# EAGLE design PQS42019.1 v5 (EAGLE 9.3.2)
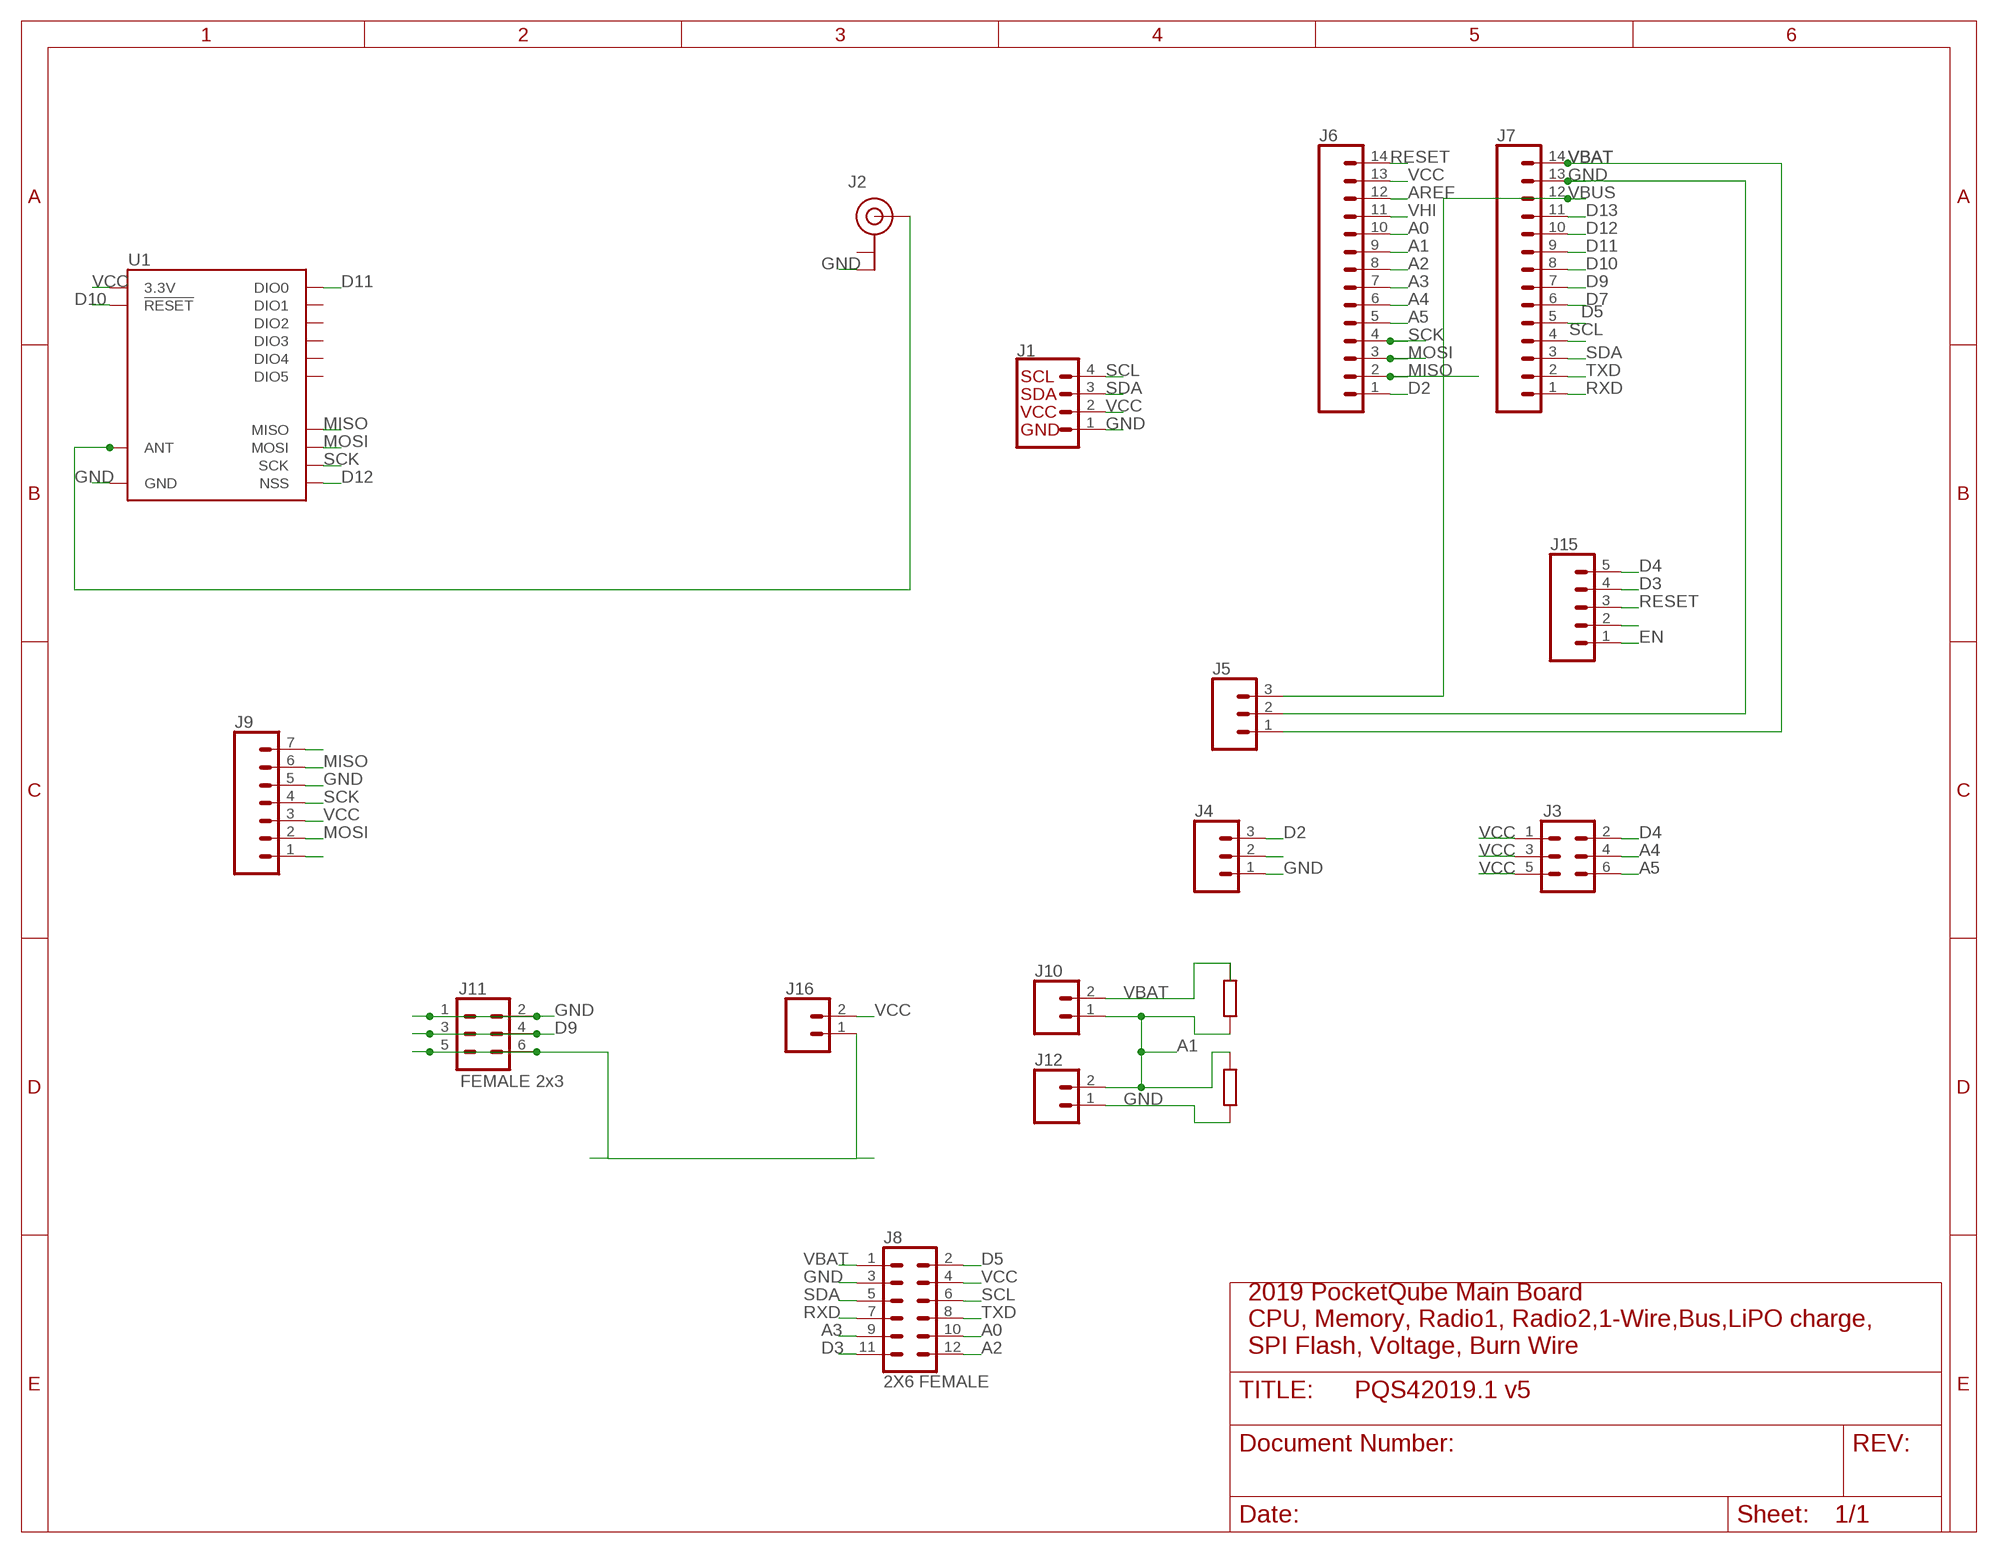
[diagram p0: schematic, sheet 1]

## Parts
J1  QWIIC_CONNECTORJS-1MM  [1X04_1MM_RA]
J2  U.FL  [U.FL]
J3  CONN_03X2NO_SILK  [2X3-NS]
J4  CONN_03  [1X03]
J5  CONN_03  [1X03]
J6  CONN_14  [1X14]
J7  CONN_14  [1X14]
J8  2X6 FEMALE  CONN_06X2PTH_FEMALE  [2X6]
J9  CONN_07  [1X07]
J10  CONN_02  [1X02]
J11  FEMALE 2x3  CONN_03X2FEMALE  [2X3]
J12  CONN_02  [1X02]
J15  CONN_05  [1X05]
J16  CONN_02  [1X02]
U1  RFM95W  [RFM95/96/97/98W]

## Nets
A0: J6.10 J8.10
A1: J6.9 J10.1 J12.2
A2: J6.8 J8.12
A3: J6.7 J8.9
A4: J3.4 J6.6
A5: J3.6 J6.5
AREF: J6.12
D2: J4.3 J6.1
D3: J8.11 J15.4
D4: J3.2 J15.5
D5: J7.5 J8.2
D7: J7.6 J9.1
D9: J7.7 J11.3 J11.4
D10: J7.8 U1.!RESET
D11: J7.9 U1.DIO0
D12: J7.10 U1.NSS
D13: J7.11
EN: J15.1
GND [power]: J1.1(GND) J2.2(GND) J4.1 J5.2 J7.13 J8.3 J9.5 J11.1 J11.2 J12.1 U1.GND@1(GND) U1.GND@2(GND) U1.GND@3(GND)
MISO: J6.2 J9.6 U1.MISO
MOSI: J6.3 J9.2 U1.MOSI
N$1: J9.7
N$2: J4.2
N$8: J15.2
N$10: J11.5 J11.6 J16.1
N$13: J2.FEED(SIGNAL) U1.ANT
RESET: J6.14 J15.3
RXD: J7.1 J8.7
SCK: J6.4 J9.4 U1.SCK
SCL: J1.4(SCL) J7.4 J8.6
SDA: J1.3(SDA) J7.3 J8.5
TXD: J7.2 J8.8
VBAT [power]: J5.1 J7.14 J8.1 J10.2
VBUS [power]: J5.3 J7.12
VCC: J1.2(VCC) J3.1 J3.3 J3.5 J6.13 J8.4 J9.3 J16.2 U1.3.3V
VHI: J6.11
Unconnected: J2.1(GND) U1.DIO1 U1.DIO2 U1.DIO3 U1.DIO4 U1.DIO5

## Notes on the sheet
- 2019 PocketQube Main Board
  CPU, Memory, Radio1, Radio2,1-Wire,Bus,LiPO charge, 
  SPI Flash, Voltage, Burn Wire

## Library data of the parts
J1 = SparkFun-Connectors:QWIIC_CONNECTOR: SparkFun I2C Standard Qwiic Connector An SMD 1mm pitch JST connector makes it easy and quick (get it? Qwiic?) to connect I2C devices to each other. The Qwiic system <http://www.sparkfun.com/qwiic> enables fast and solderless connection between popular platforms and various sensors and actuators. We carry 200mm <https://www.sparkfun.com/products/14204>, 100mm <https://www.sparkfun.com/products/14205>, 50mm <https://www.sparkfun.com/products/14206>, and breadboard friendly <https://www.sparkfun.com/products/14207> Qwiic cables. We also offer 10 pcs strips <https://www.sparkfun.com/products/14323> the SMD connectors.
J2 = SparkFun-Connectors:U.FL: SMD Antenna Connector - U.FL 2mm height, 3.0mm x 3.0mm receptacle size. SparkFun Products: SparkFun WiFi Shield - ESP8266 <https://www.sparkfun.com/products/13287> SparkFun ESP8266 Thing <https://www.sparkfun.com/products/13231> SparkFun MiniGen - Pro Mini Signal Generator Shield <https://www.sparkfun.com/products/11420>; PROD_ID: CONN-09193; SF_ID: WRL-09144
J3 = SparkFun-Connectors:CONN_03X2: Multi connection point. Often used as Generic Header-pin footprint for 0.1 inch spaced/style header connections You can populate with any combo of single row headers, but if you'd like an exact match, check these: Header - 2x3 (Male, 0.1") <https://www.sparkfun.com/products/12807> (PRT-12807) Header - 2x3 (Female, 0.1") <https://www.sparkfun.com/products/13010> (PRT-13010) 2x3 Pin Shrouded Header <https://www.sparkfun.com/products/10877> (PRT-10877) On any of the 0.1 inch spaced packages, you can populate with these: Break Away Headers - Straight <https://www.sparkfun.com/products/116> (PRT-00116) Break Away Male Headers - Right Angle <https://www.sparkfun.com/products/553> (PRT-00553) Female Headers <https://www.sparkfun.com/products/115> (PRT-00115) Break Away Headers - Machine Pin <https://www.sparkfun.com/products/117> (PRT-00117) Break Away Female Headers - Swiss Machine Pin <https://www.sparkfun.com/products/743> (PRT-00743) Special note: the shrouded connector mates well with our 3x2 ribbon cables: Ribbon Crimp Connector - 6-pin (2x3, Female) <https://www.sparkfun.com/products/10651> (PRT-10651) Ribbon Cable - 6 wire (15ft) <https://www.sparkfun.com/products/10646> (PRT-10646)
J4 J5 = SparkFun-Connectors:CONN_03: Multi connection point. Often used as Generic Header-pin footprint for 0.1 inch spaced/style header connections On any of the 0.1 inch spaced packages, you can populate with these: Break Away Headers - Straight <https://www.sparkfun.com/products/116> (PRT-00116) Break Away Male Headers - Right Angle <https://www.sparkfun.com/products/553> (PRT-00553) Female Headers <https://www.sparkfun.com/products/115> (PRT-00115) Break Away Headers - Machine Pin <https://www.sparkfun.com/products/117> (PRT-00117) Break Away Female Headers - Swiss Machine Pin <https://www.sparkfun.com/products/743> (PRT-00743) Stackable Header - 3 Pin (Female, 0.1") <https://www.sparkfun.com/products/13875> (PRT-13875) For SCREWTERMINALS and SPRING TERMINALS visit here: Screw Terimnals on SparkFun.com <https://www.sparkfun.com/search/results?term=Screw+Terminals> (5mm/3.5mm/2.54mm spacing) This device is also useful as a general connection point to wire up your design to another part of your project. Our various solder wires solder well into these plated through hole pads. Hook-Up Wire - Assortment (Stranded, 22 AWG) <https://www.sparkfun.com/products/11375> (PRT-11375) Hook-Up Wire - Assortment (Solid Core, 22 AWG) <https://www.sparkfun.com/products/11367> (PRT-11367) View the entire wire category on our website here <https://www.sparkfun.com/categories/141> Special notes: Molex polarized connector foot print use with SKU : PRT-08232 with associated crimp pins and housings.
J6 J7 = SparkFun-Connectors:CONN_14: Multi connection point. Often used as Generic Header-pin footprint for 0.1 inch spaced/style header connections On any of the 0.1 inch spaced packages, you can populate with these: Break Away Headers - Straight <https://www.sparkfun.com/products/116> (PRT-00116) Break Away Male Headers - Right Angle <https://www.sparkfun.com/products/553> (PRT-00553) Female Headers <https://www.sparkfun.com/products/115> (PRT-00115) Break Away Headers - Machine Pin <https://www.sparkfun.com/products/117> (PRT-00117) Break Away Female Headers - Swiss Machine Pin <https://www.sparkfun.com/products/743> (PRT-00743) For SCREWTERMINALS and SPRING TERMINALS visit here: Screw Terimnals on SparkFun.com <https://www.sparkfun.com/search/results?term=Screw+Terminals> (5mm/3.5mm/2.54mm spacing) This device is also useful as a general connection point to wire up your design to another part of your project. Our various solder wires solder well into these plated through hole pads. Hook-Up Wire - Assortment (Stranded, 22 AWG) <https://www.sparkfun.com/products/11375> (PRT-11375) Hook-Up Wire - Assortment (Solid Core, 22 AWG) <https://www.sparkfun.com/products/11367> (PRT-11367) View the entire wire category on our website here <https://www.sparkfun.com/categories/141> Special notes: Molex polarized connector foot print use with SKU : PRT-08231 with associated crimp pins and housings. 1MM SMD Version SKU: PRT-10208 NOTES ON THE VARIANTS LOCK and LOCK_LONGPADS... This footprint was designed to help hold the alignment of a through-hole component (i.e. 6-pin header) while soldering it into place. You may notice that each hole has been shifted either up or down by 0.005 of an inch from it's more standard position (which is a perfectly straight line). This slight alteration caused the pins (the squares in the middle) to touch the edges of the holes. Because they are alternating, it causes a "brace" to hold the component in place. 0.005 has proven to be the perfect amount of "off-center" position when using our standard breakaway headers. Although looks a little odd when you look at the bare footprint, once you have a header in there, the alteration is very hard to notice. Also,if you push a header all the way into place, it is covered up entirely on the bottom side.
J8 = SparkFun-Connectors:CONN_06X2: Multi connection point. Often used as Generic Header-pin footprint for 0.1 inch spaced/style header connections On any of the 0.1 inch spaced packages, you can populate with these: Break Away Headers - Straight <https://www.sparkfun.com/products/116> (PRT-00116) Break Away Male Headers - Right Angle <https://www.sparkfun.com/products/553> (PRT-00553) Female Headers <https://www.sparkfun.com/products/115> (PRT-00115) Break Away Headers - Machine Pin <https://www.sparkfun.com/products/117> (PRT-00117) Break Away Female Headers - Swiss Machine Pin <https://www.sparkfun.com/products/743> (PRT-00743); PROD_ID: CONN-12423
J9 = SparkFun-Connectors:CONN_07: Multi connection point. Often used as Generic Header-pin footprint for 0.1 inch spaced/style header connections On any of the 0.1 inch spaced packages, you can populate with these: Break Away Headers - Straight <https://www.sparkfun.com/products/116> (PRT-00116) Break Away Male Headers - Right Angle <https://www.sparkfun.com/products/553> (PRT-00553) Female Headers <https://www.sparkfun.com/products/115> (PRT-00115) Break Away Headers - Machine Pin <https://www.sparkfun.com/products/117> (PRT-00117) Break Away Female Headers - Swiss Machine Pin <https://www.sparkfun.com/products/743> (PRT-00743) For SCREWTERMINALS and SPRING TERMINALS visit here: Screw Terimnals on SparkFun.com <https://www.sparkfun.com/search/results?term=Screw+Terminals> (5mm/3.5mm/2.54mm spacing) This device is also useful as a general connection point to wire up your design to another part of your project. Our various solder wires solder well into these plated through hole pads. Hook-Up Wire - Assortment (Stranded, 22 AWG) <https://www.sparkfun.com/products/11375> (PRT-11375) Hook-Up Wire - Assortment (Solid Core, 22 AWG) <https://www.sparkfun.com/products/11367> (PRT-11367) View the entire wire category on our website here <https://www.sparkfun.com/categories/141> Special notes: Molex polarized connector foot print use with SKU : PRT-08231 with associated crimp pins and housings. 1MM SMD Version SKU: PRT-10208 NOTES ON THE VARIANTS LOCK and LOCK_LONGPADS... This footprint was designed to help hold the alignment of a through-hole component (i.e. 6-pin header) while soldering it into place. You may notice that each hole has been shifted either up or down by 0.005 of an inch from it's more standard position (which is a perfectly straight line). This slight alteration caused the pins (the squares in the middle) to touch the edges of the holes. Because they are alternating, it causes a "brace" to hold the component in place. 0.005 has proven to be the perfect amount of "off-center" position when using our standard breakaway headers. Although looks a little odd when you look at the bare footprint, once you have a header in there, the alteration is very hard to notice. Also,if you push a header all the way into place, it is covered up entirely on the bottom side.
J10 J12 J16 = SparkFun-Connectors:CONN_02: Multi connection point. Often used as Generic Header-pin footprint for 0.1 inch spaced/style header connections On any of the 0.1 inch spaced packages, you can populate with these: Break Away Headers - Straight <https://www.sparkfun.com/products/116> (PRT-00116) Break Away Male Headers - Right Angle <https://www.sparkfun.com/products/553> (PRT-00553) Female Headers <https://www.sparkfun.com/products/115> (PRT-00115) Break Away Headers - Machine Pin <https://www.sparkfun.com/products/117> (PRT-00117) Break Away Female Headers - Swiss Machine Pin <https://www.sparkfun.com/products/743> (PRT-00743) For SCREWTERMINALS and SPRING TERMINALS visit here: Screw Terimnals on SparkFun.com <https://www.sparkfun.com/search/results?term=Screw+Terminals> (5mm/3.5mm/2.54mm spacing) This device is also useful as a general connection point to wire up your design to another part of your project. Our various solder wires solder well into these plated through hole pads. Hook-Up Wire - Assortment (Stranded, 22 AWG) <https://www.sparkfun.com/products/11375> (PRT-11375) Hook-Up Wire - Assortment (Solid Core, 22 AWG) <https://www.sparkfun.com/products/11367> (PRT-11367) View the entire wire category on our website here <https://www.sparkfun.com/categories/141> Special notes: Molex polarized connector foot print use with: PRT-08233 with associated crimp pins and housings. 2.54_SCREWTERM for use with PRT-10571. 3.5mm Screw Terminal footprints for PRT-08084 5mm Screw Terminal footprints for use with PRT-08432
J11 = SparkFun-Connectors:CONN_03X2: Multi connection point. Often used as Generic Header-pin footprint for 0.1 inch spaced/style header connections You can populate with any combo of single row headers, but if you'd like an exact match, check these: Header - 2x3 (Male, 0.1") <https://www.sparkfun.com/products/12807> (PRT-12807) Header - 2x3 (Female, 0.1") <https://www.sparkfun.com/products/13010> (PRT-13010) 2x3 Pin Shrouded Header <https://www.sparkfun.com/products/10877> (PRT-10877) On any of the 0.1 inch spaced packages, you can populate with these: Break Away Headers - Straight <https://www.sparkfun.com/products/116> (PRT-00116) Break Away Male Headers - Right Angle <https://www.sparkfun.com/products/553> (PRT-00553) Female Headers <https://www.sparkfun.com/products/115> (PRT-00115) Break Away Headers - Machine Pin <https://www.sparkfun.com/products/117> (PRT-00117) Break Away Female Headers - Swiss Machine Pin <https://www.sparkfun.com/products/743> (PRT-00743) Special note: the shrouded connector mates well with our 3x2 ribbon cables: Ribbon Crimp Connector - 6-pin (2x3, Female) <https://www.sparkfun.com/products/10651> (PRT-10651) Ribbon Cable - 6 wire (15ft) <https://www.sparkfun.com/products/10646> (PRT-10646); PROD_ID: CONN-11566
J15 = SparkFun-Connectors:CONN_05: Multi connection point. Often used as Generic Header-pin footprint for 0.1 inch spaced/style header connections On any of the 0.1 inch spaced packages, you can populate with these: Break Away Headers - Straight <https://www.sparkfun.com/products/116> (PRT-00116) Break Away Male Headers - Right Angle <https://www.sparkfun.com/products/553> (PRT-00553) Female Headers <https://www.sparkfun.com/products/115> (PRT-00115) Break Away Headers - Machine Pin <https://www.sparkfun.com/products/117> (PRT-00117) Break Away Female Headers - Swiss Machine Pin <https://www.sparkfun.com/products/743> (PRT-00743) For SCREWTERMINALS and SPRING TERMINALS visit here: Screw Terimnals on SparkFun.com <https://www.sparkfun.com/search/results?term=Screw+Terminals> (5mm/3.5mm/2.54mm spacing) This device is also useful as a general connection point to wire up your design to another part of your project. Our various solder wires solder well into these plated through hole pads. Hook-Up Wire - Assortment (Stranded, 22 AWG) <https://www.sparkfun.com/products/11375> (PRT-11375) Hook-Up Wire - Assortment (Solid Core, 22 AWG) <https://www.sparkfun.com/products/11367> (PRT-11367) View the entire wire category on our website here <https://www.sparkfun.com/categories/141> Special notes: Molex polarized connector foot print use with SKU : PRT-08231 with associated crimp pins and housings. 1MM SMD Version SKU: PRT-10208
U1 = SparkFun-RF:RFM95W: RFM95/96/97/98 The RFM95/96/97/98(W) transceivers feature the LoRaTM long range modem that provides ultra-long range spread spectrum communication and high interference immunity whilst minimising current consumption. These devices also support high performance (G)FSK modes for systems including WMBus, IEEE802.15.4g. The RFM95/96/97/98(W) deliver exceptional phase noise, selectivity, receiver linearity and IIP3 for significantly lower current consumption than competing devices Datasheet <http://www.hoperf.com/upload/rf/RFM95_96_97_98W.pdf>; PROD_ID: IC-13959

## Net classes
1 power: width 0.305 mm

## Board
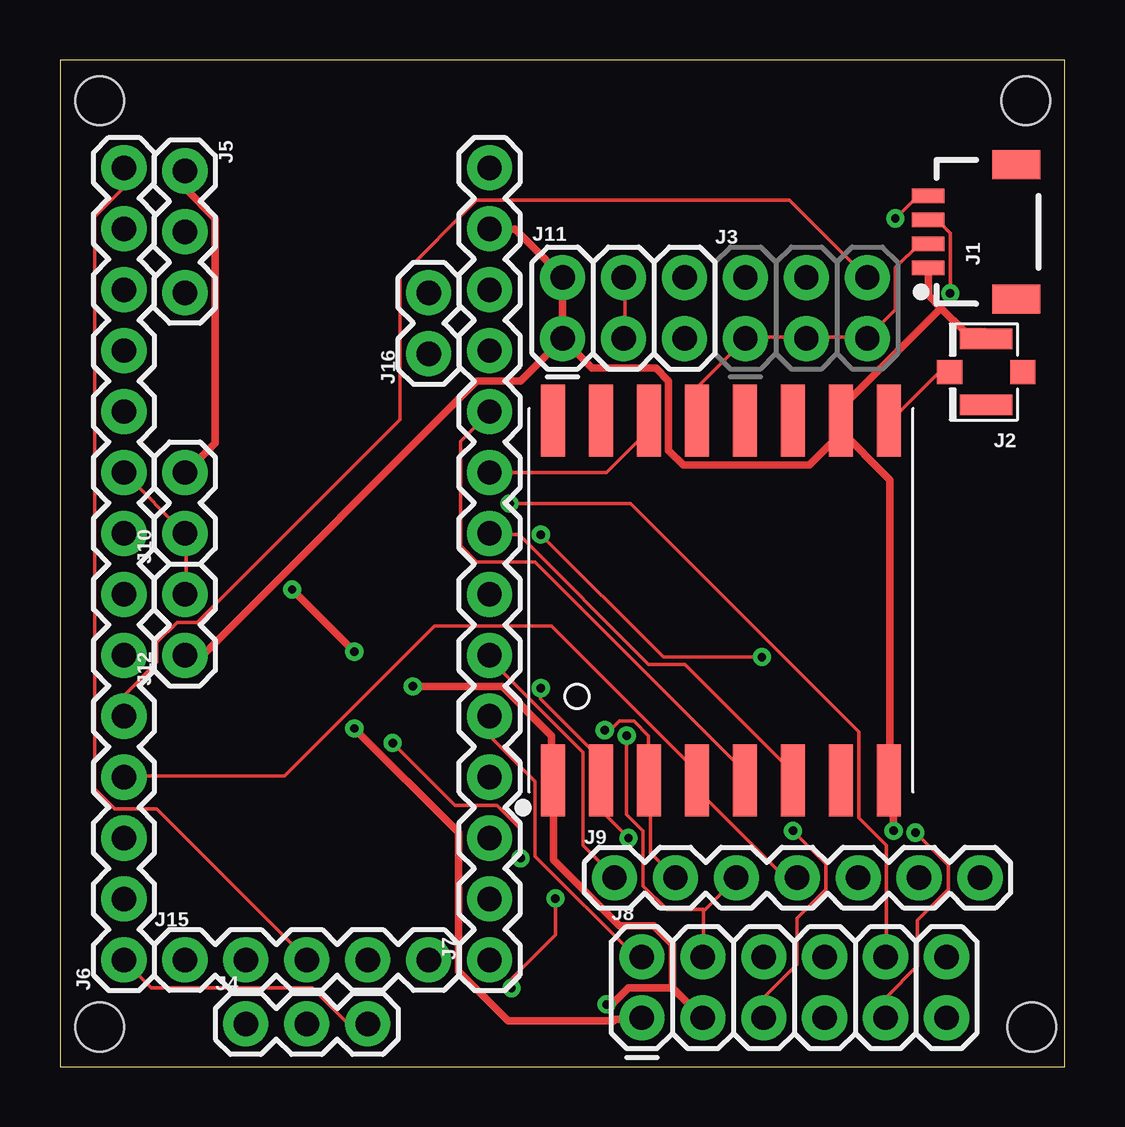
[diagram p1: board, top side]
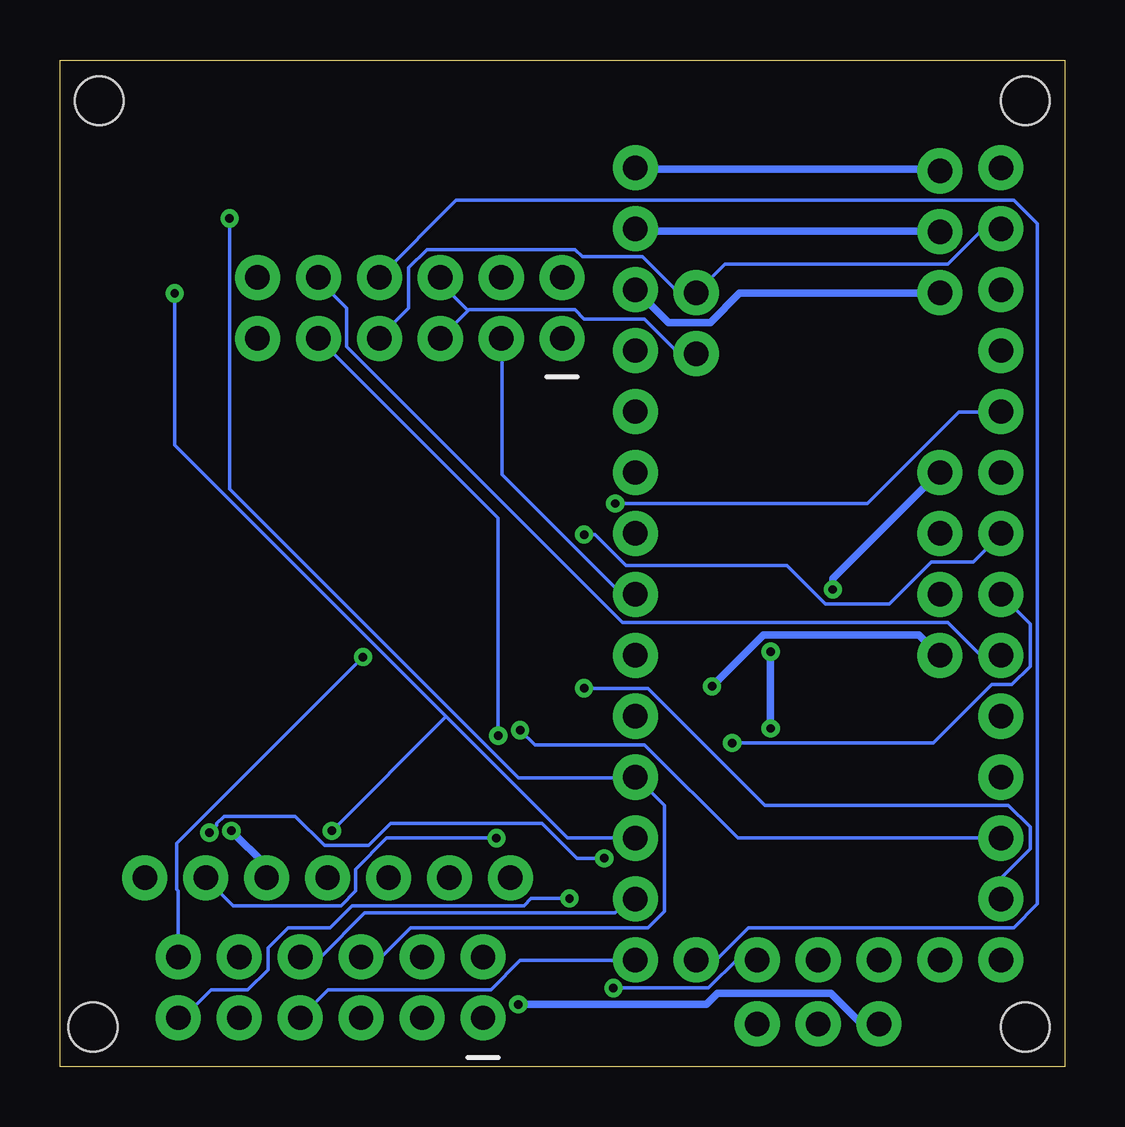
[diagram p2: board, bottom side, seen from below]

Size 41.89 x 41.96 mm. Coordinates in mm from the lower left corner, seen from the top.
Outline: 0,41.96 0,0 41.89,0 41.89,41.96 0,41.96
Copper layers (1*16): Top 0.035mm / dielectric 1.5mm / Bottom 0.035mm
Design rules "default": minimum track width 6mil, minimum drill 0.35mm, track to track 6mil, track to pad 6mil, pad to pad 6mil, via to via 6mil, smd to smd 6mil, copper to edge 40mil, drill to drill 6mil, minimum pad ring 10mil, minimum via ring 8mil, stop-mask expansion 4mil, vias tented up to drill 0mil, thermal gap 10mil
Holes 2.03 mm at 1.65,1.65 40.26,40.26 40.51,1.65 1.65,40.26

### Footprints (pad centres in the part's own frame; a part is rotated, then mirrored left to right if it is on the bottom)
1X04_1MM_RA = smd 0.6 x 1.35: 1 -1.5,0; 2 -0.5,0; 3 0.5,0; 4 1.5,0 | smd 1.2 x 2: NC1 2.8,-3.675; NC2 -2.8,-3.675
U.FL = smd 2.2 x 0.85: 1 0,1.375; 2 0,-1.375 | smd 1.05 x 1: FEED 1.525,0; NC -1.525,0
2X3-NS = drill 1.016 pad 1.88: 1 -2.54,-1.27; 2 -2.54,1.27; 3 0,-1.27; 4 0,1.27; 5 2.54,-1.27; 6 2.54,1.27
1X03 = drill 1.016 pad 1.88: 1 0,0; 2 2.54,0; 3 5.08,0
1X14 = drill 1.016 pad 1.88: 1 0,0; 2 2.54,0; 3 5.08,0; 4 7.62,0; 5 10.16,0; 6 12.7,0; 7 15.24,0; 8 17.78,0; 9 20.32,0; 10 22.86,0; 11 25.4,0; 12 27.94,0; 13 30.48,0; 14 33.02,0
2X6 = drill 1.016 pad 1.88: 1 0,0; 2 0,2.54; 3 2.54,0; 4 2.54,2.54; 5 5.08,0; 6 5.08,2.54; 7 7.62,0; 8 7.62,2.54; 9 10.16,0; 10 10.16,2.54; 11 12.7,0; 12 12.7,2.54
1X07 = drill 1.016 pad 1.88: 1 0,0; 2 2.54,0; 3 5.08,0; 4 7.62,0; 5 10.16,0; 6 12.7,0; 7 15.24,0
1X02 = drill 1.016 pad 1.88: 1 0,0; 2 2.54,0
2X3 = drill 1.016 pad 1.88: 1 0,0; 2 0,2.54; 3 2.54,0; 4 2.54,2.54; 5 5.08,0; 6 5.08,2.54
1X05 = drill 1.016 pad 1.88: 1 0,0; 2 2.54,0; 3 5.08,0; 4 7.62,0; 5 10.16,0
RFM95/96/97/98W = smd 3 x 1: 3.3V 7.5,1; !RESET -7.5,-3; ANT 7.5,-7; DIO0 7.5,3; DIO1 7.5,5; DIO2 7.5,7; DIO3 7.5,-3; DIO4 7.5,-1; DIO5 -7.5,-5; GND@1 -7.5,7; GND@2 -7.5,-7; GND@3 7.5,-5; MISO -7.5,5; MOSI -7.5,3; NSS -7.5,-1; SCK -7.5,1

### Placement (x,y rotation side)
J1  36.2,34.8 90 top
J2  38.61,28.96 180 top
J3  31.11,31.62 0 top
J4  7.75,1.78 0 top
J5  5.21,37.34 270 top
J6  2.67,4.45 90 top
J7  17.91,4.45 90 top
J8  24.26,2.03 0 top
J9  23.11,7.87 0 top
J10  5.21,22.23 90 top
J11  20.95,30.35 0 top
J12  5.21,17.14 90 top
J15  5.21,4.45 0 top
J16  15.37,29.72 90 top
U1  27.56,19.43 90 top

### Tracks (layer width: path | path; a pad name or v marks a point on that pad's centre or on a via)
A0  (via drill 0.35)
  Top 0.152: v18.75,23.47 23.77,23.47 33.3,13.95 33.3,10.36 34.44,9.22 34.44,4.57 J8.10
  Bottom 0.152: v18.75,23.47 8.23,23.47 4.42,27.28 2.67,27.28 J6.10
A1
  Top 0.152: J6.9 J10.1 5.26,22.17 5.26,19.74 J12.2
  Bottom 0.152: 5.18,19.68 J12.2
A2  (via drill 0.35)
  Top 0.152: v29.26,17.07 25.15,17.07 v20.04,22.17
  Bottom 0.152: 2.67,22.25 J6.8 2.67,22.17 3.81,21.03 5.56,21.03 7.32,19.28 9.98,19.28 11.58,20.88 18.29,20.88 19.58,22.17 v20.04,22.17 | J8.12 36.96,7.32 37.03,7.39 37.03,9.3 v29.26,17.07
A3  (via drill 0.35)
  Top 0.152: v35.66,9.75 37.03,8.38 37.03,7.39 35.74,6.1 35.74,4.19 34.44,2.9 34.44,2.06 J8.9 | v19.2,8.69 19.2,9.91 18.21,10.9 16.46,10.9 v13.87,13.49
  Bottom 0.152: 2.67,19.74 J6.7 2.67,19.66 1.45,18.44 1.45,16.69 2.21,15.93 3.05,15.93 5.49,13.49 v13.87,13.49 | v35.66,9.75 35.36,10.06 35.36,10.13 35.05,10.44 32.08,10.44 30.86,9.22 29.03,9.22 28.12,10.13 21.79,10.13 20.34,8.69 v19.2,8.69
A4
  Bottom 0.152: 31.09,32.84 J3.4 31.09,32.77 29.95,31.62 29.95,30.02 18.44,18.52 4.88,18.52 3.5,17.14 J6.6
A5
  Top 0.152: J6.5 2.67,15.47 4.04,16.84 4.04,17.68 4.88,18.52 5.71,18.52 14.17,26.98 14.17,32.92 17.37,36.12 30.4,36.12 33.6,32.92 J3.6
  Bottom 0.152: 2.67,14.63 J6.5
D2
  Top 0.152: J4.3 12.8,1.83 11.96,1.83 10.52,3.28 3.81,3.28 2.67,4.42 J6.1
  Bottom 0.152: 12.8,1.83 J4.3 | 2.67,4.42 J6.1
D3  (via drill 0.35)
  Top 0.152: v18.82,3.28 18.82,3.66 20.65,5.49 v20.65,7.01
  Bottom 0.152: 12.78,4.45 J15.4 | 36.91,2.03 J8.11 | 12.88,4.45 J15.4 | 36.88,2.06 J8.11 | 12.93,4.5 J15.4 | 12.93,4.57 J15.4 | 12.93,4.65 J15.4 | 36.8,2.06 J8.11 | 12.95,4.5 J15.4 | v18.82,3.28 14.86,3.28 13.64,4.5 13.03,4.5 J15.4 | v20.65,7.01 22.25,7.01 22.55,6.71 29.72,6.71 30.63,5.79 32.38,5.79 33.22,4.95 33.22,4.04 34.06,3.2 35.59,3.2 36.73,2.06 J8.11
D4
  Bottom 0.152: J15.5 15.32,4.5 14.48,4.5 13.18,5.79 2.13,5.79 1.14,6.78 1.14,35.13 2.13,36.12 25.38,36.12 28.57,32.92 J3.2
D5
  Top 0.152: J7.5 17.91,13.79 19.81,11.89 19.81,8.76 24,4.57 J8.2
D7
  Top 0.152: J7.6 17.91,16.99 21.79,13.11 21.79,9.22 23.09,7.92 J9.1
D9
  Top 0.152: J11.4 23.55,32.84 23.55,30.4 J11.3
  Bottom 0.152: 17.88,19.66 J7.7 | 17.96,19.74 J7.7 | 17.98,19.74 J7.7 | 23.55,32.84 J11.4 | 23.55,30.4 J11.3 23.47,30.33 23.47,24.69 18.52,19.74 18.06,19.74 J7.7
D10
  Top 0.152: 30.56,11.58 30.56,11.89 U1.!RESET 30.56,11.96 30.56,12.27 26.06,16.76 24.54,16.76 19.13,22.17 17.91,22.17 J7.8
D11
  Top 0.152: 24.54,26.52 24.54,26.9 U1.DIO0 24.54,26.52 | 24.54,26.52 22.78,24.77 J7.9
D12
  Top 0.152: 28.5,11.96 U1.NSS 28.5,12.04 28.5,12.34 19.81,21.03 17.37,21.03 16.69,21.72 16.69,26.06 17.91,27.28 J7.10
D13
  Bottom 0.152: 17.91,29.82 J7.11
GND  (via drill 0.35)
  Top 0.305: 38.66,30.38 J2.2 | 38.51,30.23 J2.2 | 38.76,30.28 J2.2 | 38.46,30.12 J2.2 | 38.56,30.63 J2.2 | 32.61,27.43 32.61,26.98 U1.GND@3 | 34.52,11.89 U1.GND@2 | 20.57,11.89 U1.GND@1 | 32.46,26.82 U1.GND@3 | 34.59,12.04 U1.GND@2 | J1.1 36.2,32.16 36.73,31.62 | 36.73,31.62 37.72,30.63 38.41,30.63 J2.2 | 36.73,31.62 32.61,27.51 U1.GND@3 | U1.GND@2 34.59,12.19 34.59,24.46 32.46,26.59 32.46,26.67 U1.GND@3 | v34.75,9.83 34.75,11.51 34.52,11.73 U1.GND@2 | 25.53,3.28 25.53,5.11 24.77,5.87 23.32,5.87 20.57,8.61 20.57,11.73 U1.GND@1 | 25.53,3.28 26.75,2.06 J8.3 | v22.78,2.59 23.01,2.59 23.7,3.28 25.53,3.28 | J12.1 5.94,17.14 17.37,28.57 19.2,28.57 20.95,30.33 J11.1 | J11.1 J11.2 20.88,32.99 18.97,34.9 17.91,34.9 J7.13 | v14.71,15.85 18.44,15.85 20.5,13.79 20.5,12.04 U1.GND@1 | U1.GND@3 32.54,26.36 31.24,25.07 25.98,25.07 25.38,25.68 25.38,28.57 24.84,29.11 22.17,29.11 21.03,30.25 J11.1
  Bottom 0.305: 26.75,2.06 J8.3 | 5.23,34.77 J5.2 | 5.33,34.82 J5.2 | 17.83,34.82 J7.13 17.68,34.82 5.49,34.82 J5.2 | v34.75,9.83 33.3,8.38 33.3,7.92 J9.5 | v22.78,2.59 14.94,2.59 14.48,3.05 9.75,3.05 8.53,1.83 7.77,1.83 J4.1 | v14.71,15.85 12.57,17.98 6.1,17.98 5.26,17.14 J12.1
MISO  (via drill 0.35)
  Top 0.152: 22.55,12.27 22.55,11.96 U1.MISO | v23.7,9.53 22.63,10.59 22.63,11.89 U1.MISO | v20.04,15.77 20.04,15.32 22.55,12.8 22.55,12.27 | 22.55,12.27 U1.MISO
  Bottom 0.152: v23.7,9.53 28.27,9.53 29.57,8.23 29.57,7.32 30.18,6.71 34.67,6.71 35.81,7.85 J9.6 | J6.2 2.67,7.85 1.45,9.07 1.45,9.98 2.36,10.9 12.5,10.9 17.37,15.77 v20.04,15.77
MOSI  (via drill 0.35)
  Top 0.152: 24.61,11.89 U1.MOSI | J9.2 24.61,8.91 24.61,11.81 U1.MOSI | v22.71,14.02 22.94,14.02 23.32,14.4 23.93,14.4 24.54,13.79 24.54,11.96 U1.MOSI
  Bottom 0.152: J6.3 13.64,9.53 17.53,13.41 22.1,13.41 v22.71,14.02
N$10
  Bottom 0.152: J16.1 16.08,29.72 17.53,31.17 20.04,31.17 20.42,31.55 24.84,31.55 24.88,31.51 | J11.5 24.88,31.51 | 24.88,31.51 25.98,32.61 25.98,32.84 J11.6
N$13
  Top 0.152: 37.13,29.01 J2.FEED | 37.24,29.06 J2.FEED | 37.24,29.13 J2.FEED | 34.59,26.98 U1.ANT 34.67,26.98 36.65,28.96 J2.FEED
RESET
  Top 0.152: J6.14 2.67,36.65 1.45,35.43 1.45,11.58 2.29,10.74 4.04,10.74 10.29,4.5 J15.3
  Bottom 0.152: 10.26,4.5 J15.3
RXD
  Bottom 0.152: J8.7 30.71,3.2 23.93,3.2 22.71,4.42 17.91,4.42 J7.1
SCK
  Top 0.152: 26.52,12.34 26.52,11.96 U1.SCK | U1.SCK 26.59,11.89 26.59,11.51 30.18,7.92 30.71,7.92 J9.4 | 26.52,12.34 20.5,18.36 15.62,18.36 9.37,12.12 2.67,12.12 J6.4 | 26.52,12.34 U1.SCK
  Bottom 0.152: 2.67,12.04 J6.4
SCL  (via drill 0.35)
  Top 0.152: 35.74,36.27 36.2,36.27 J1.4 35.74,36.27 | v34.82,35.36 35.74,36.27
  Bottom 0.152: 29.29,4.62 J8.6 29.26,4.65 28.42,4.65 27.28,5.79 17.37,5.79 16.69,6.48 16.69,10.9 17.83,12.04 J7.4 | 18.03,12.04 J7.4 | 18.11,12.04 J7.4 | v34.82,35.36 34.82,24.08 22.78,12.04 18.14,12.04 J7.4
SDA  (via drill 0.35)
  Top 0.152: v37.11,32.23 37.11,34.75 36.58,35.28 36.2,35.28 J1.3 | J8.5 29.34,2.9 30.71,4.27 30.71,6.17 31.93,7.39 31.93,8.46 v30.56,9.83
  Bottom 0.152: 29.29,2.03 J8.5 29.26,2.06 | 17.91,9.45 J7.3 20.73,9.53 25.79,14.59 | v37.11,32.23 37.11,25.91 25.79,14.59 | 25.79,14.59 v30.56,9.83
TXD
  Bottom 0.152: 17.88,7.04 J7.2 | 17.8,7.04 J7.2 | 17.96,6.96 J7.2 | 17.98,6.96 J7.2 | 17.8,7.09 J7.2 | 18.03,6.93 J7.2 | 18.11,6.93 J7.2 | 18.14,6.93 J7.2 | J8.8 31.01,4.57 29.18,6.4 18.75,6.4 18.21,6.93 J7.2
VBAT  (via drill 0.35)
  Top 0.305: v12.27,14.1 16.61,9.75 16.61,3.96 18.67,1.91 23.09,1.91 23.16,1.98 24.23,1.98 J8.1 | v9.68,19.89 v12.27,17.3 | J5.1 5.26,37.34 5.26,36.58 6.48,35.36 6.48,25.98 5.26,24.77 J10.2
  Bottom 0.305: 17.88,37.41 J7.14 | 5.18,37.34 J5.1 5.33,37.41 17.6,37.41 J7.14 | 17.75,37.41 J7.14 | v12.27,17.3 v12.27,14.1 | v9.68,19.89 9.68,20.34 5.26,24.77 J10.2
VBUS
  Bottom 0.305: 5.26,32.23 J5.3 5.41,32.23 13.56,32.23 14.78,31.01 16.54,31.01 J7.12
VCC  (via drill 0.35)
  Top 0.152: 26.59,28.35 26.59,26.98 U1.3.3V 26.59,28.35 | 35.81,34.29 J1.2 35.81,34.29 | 26.86,6.51 28.19,7.85 J9.3 | 26.86,6.51 26.82,6.48 26.82,4.57 J8.4 | 26.59,28.35 28.57,30.33 J3.1 28.57,30.4 31.09,30.4 J3.3 31.17,30.4 33.6,30.4 J3.5 33.68,30.4 34.82,31.55 34.82,33.3 35.81,34.29 | v23.62,13.79 23.62,10.52 24.31,9.83 24.31,7.54 25.3,6.55 26.82,6.55 26.86,6.51
  Bottom 0.152: 15.34,32.28 J16.2 | 15.39,32.31 J16.2 | J16.2 14.17,33.45 4.88,33.45 3.43,34.9 2.67,34.9 J6.13 | J16.2 15.47,32.31 16.15,32.31 17.6,33.76 20.12,33.76 20.42,34.06 26.59,34.06 27.36,33.3 27.36,31.62 28.57,30.4 J3.1 | v23.62,13.79 23.62,22.86 J3.3